# EasyEDA schematic EasyEDA_Source.json
TITLE: Meadow CCM Add-on Module - Dual Ethernet; REV: v1.b; Date: 2022.03; Sheet: 1/1; Drawn By: bryan costanich; Company: Wilderness Labs
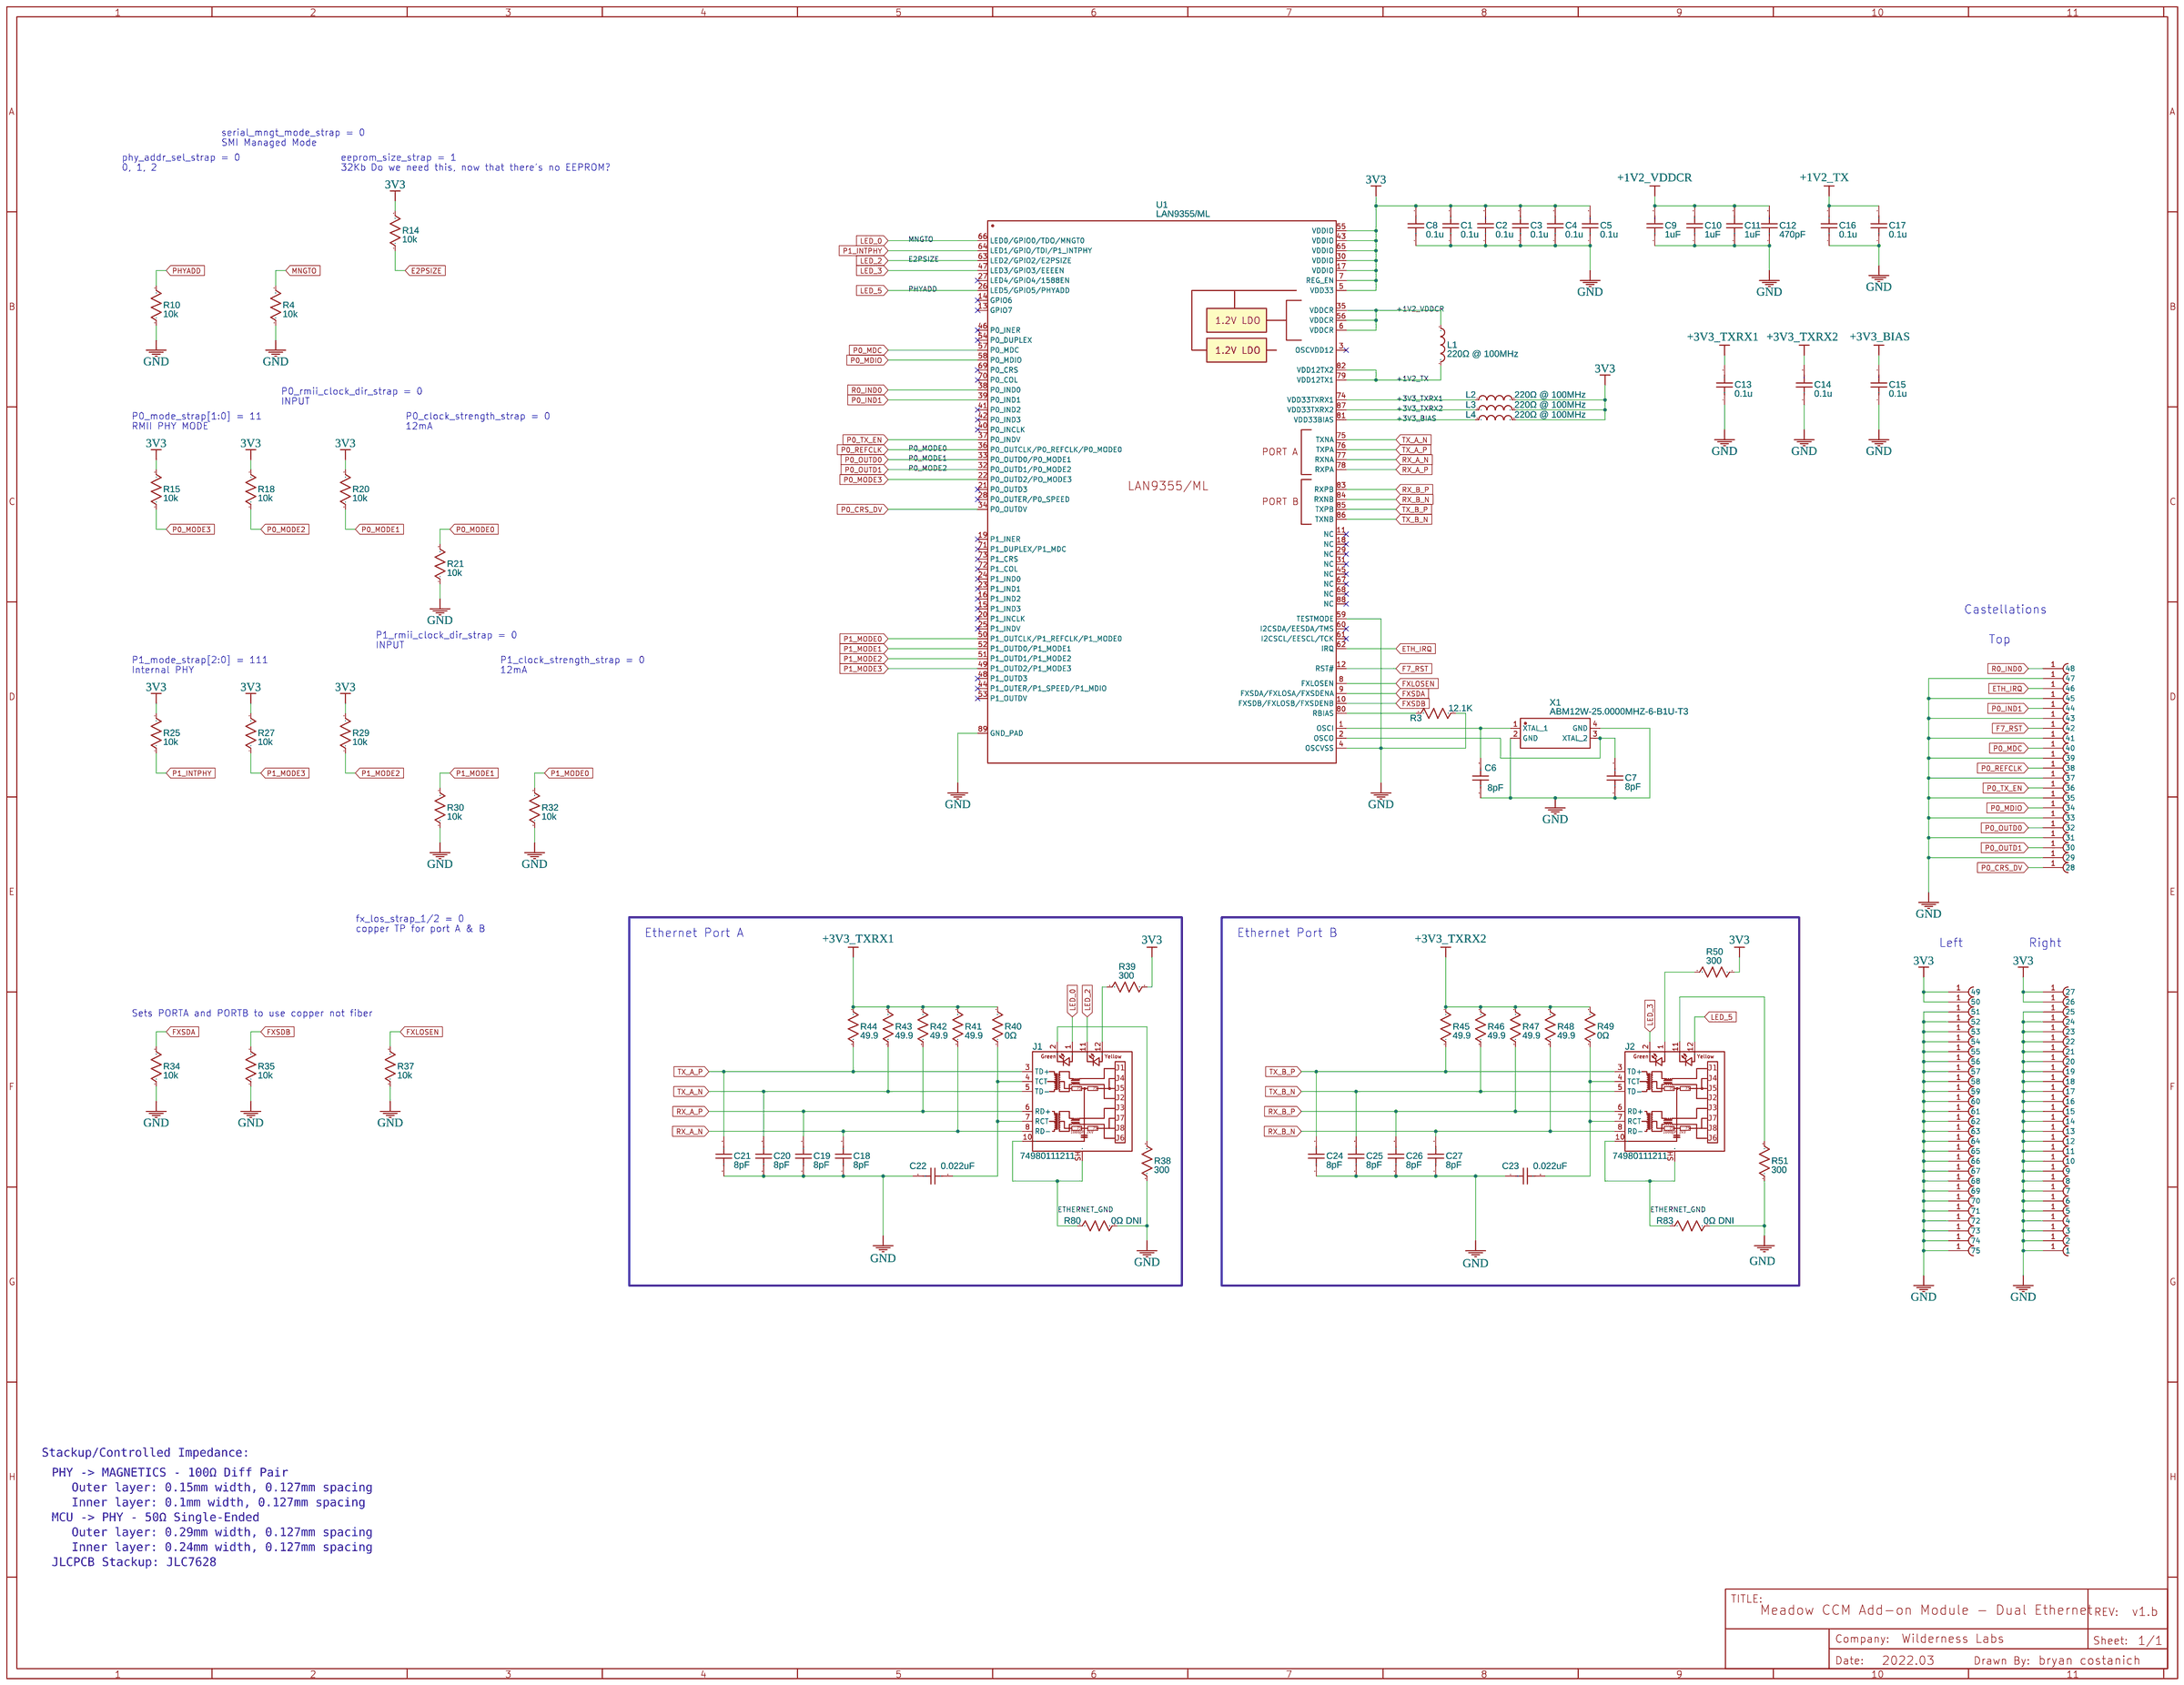
[diagram p0: schematic sheet]

## Parts
C1  0.1u  [C0603]
C2  0.1u  [C0603]
C3  0.1u  [C0603]
C4  0.1u  [C0603]
C5  0.1u  [C0603]
C6  8pF  [C0603]
C7  8pF  [C0603]
C8  0.1u  [C0603]
C9  1uF  [C0603]
C10  1uF  [C0603]
C11  1uF  [C0603]
C12  470pF  [C0603]
C13  0.1u  [C0603]
C14  0.1u  [C0603]
C15  0.1u  [C0603]
C16  0.1u  [C0603]
C17  0.1u  [C0603]
C18  8pF  [C0603]
C19  8pF  [C0603]
C20  8pF  [C0603]
C21  8pF  [C0603]
C22  0.022uF  [C0603]
C23  0.022uF  [C0603]
C24  8pF  [C0603]
C25  8pF  [C0603]
C26  8pF  [C0603]
C27  8pF  [C0603]
J1  74980111211  [74980111211]
J2  74980111211  [74980111211]
L1  220Ω @ 100MHz  [L0603]
L2  220Ω @ 100MHz  [L0603]
L3  220Ω @ 100MHz  [L0603]
L4  220Ω @ 100MHz  [L0603]
R3  12.1K  [R0603]
R4  10k  [R0603]
R10  10k  [R0603]
R14  10k  [R0603]
R15  10k  [R0603]
R18  10k  [R0603]
R20  10k  [R0603]
R21  10k  [R0603]
R25  10k  [R0603]
R27  10k  [R0603]
R29  10k  [R0603]
R30  10k  [R0603]
R32  10k  [R0603]
R34  10k  [R0603]
R35  10k  [R0603]
R37  10k  [R0603]
R38  300  [R0603]
R39  300  [R0603]
R40  0Ω  [R0603]
R41  49.9  [R0603]
R42  49.9  [R0603]
R43  49.9  [R0603]
R44  49.9  [R0603]
R45  49.9  [R0603]
R46  49.9  [R0603]
R47  49.9  [R0603]
R48  49.9  [R0603]
R49  0Ω  [R0603]
R50  300  [R0603]
R51  300  [R0603]
R80  0Ω DNI  [R0603]
R83  0Ω DNI  [R0603]
U1  LAN9355/ML  [QFN-88_L12.0-W12.0-P0.5]
U2  1.2MM SMT Castellation  [1.2MM SMT CASTELLATION]
U3  1.2MM SMT Castellation  [1.2MM SMT CASTELLATION]
U4  1.2MM SMT Castellation  [1.2MM SMT CASTELLATION]
U5  1.2MM SMT Castellation  [1.2MM SMT CASTELLATION]
U6  1.2MM SMT Castellation  [1.2MM SMT CASTELLATION]
U7  1.2MM SMT Castellation  [1.2MM SMT CASTELLATION]
U8  1.2MM SMT Castellation  [1.2MM SMT CASTELLATION]
U9  1.2MM SMT Castellation  [1.2MM SMT CASTELLATION]
U10  1.2MM SMT Castellation  [1.2MM SMT CASTELLATION]
U11  1.2MM SMT Castellation  [1.2MM SMT CASTELLATION]
U12  WILDERNESS_LABS_LOGO_HORIZONTAL_MEDIUM  [WILDERNESS_LABS_LOGO_HORIZONTAL_MEDIUM]
U13  1.2MM SMT Castellation  [1.2MM SMT CASTELLATION]
U14  1.2MM SMT Castellation  [1.2MM SMT CASTELLATION]
U15  1.2MM SMT Castellation  [1.2MM SMT CASTELLATION]
U16  1.2MM SMT Castellation  [1.2MM SMT CASTELLATION]
U17  1.2MM SMT Castellation  [1.2MM SMT CASTELLATION]
U18  1.2MM SMT Castellation  [1.2MM SMT CASTELLATION]
U19  1.2MM SMT Castellation  [1.2MM SMT CASTELLATION]
U20  1.2MM SMT Castellation  [1.2MM SMT CASTELLATION]
U21  1.2MM SMT Castellation  [1.2MM SMT CASTELLATION]
U22  1.2MM SMT Castellation  [1.2MM SMT CASTELLATION]
U23  1.2MM SMT Castellation  [1.2MM SMT CASTELLATION]
U24  1.2MM SMT Castellation  [1.2MM SMT CASTELLATION]
U25  1.2MM SMT Castellation  [1.2MM SMT CASTELLATION]
U26  1.2MM SMT Castellation  [1.2MM SMT CASTELLATION]
U27  1.2MM SMT Castellation  [1.2MM SMT CASTELLATION]
U28  1.2MM SMT Castellation  [1.2MM SMT CASTELLATION]
U29  1.2MM SMT Castellation  [1.2MM SMT CASTELLATION]
U30  1.2MM SMT Castellation  [1.2MM SMT CASTELLATION]
U31  1.2MM SMT Castellation  [1.2MM SMT CASTELLATION]
U32  1.2MM SMT Castellation  [1.2MM SMT CASTELLATION]
U33  1.2MM SMT Castellation  [1.2MM SMT CASTELLATION]
U34  1.2MM SMT Castellation  [1.2MM SMT CASTELLATION]
U35  1.2MM SMT Castellation  [1.2MM SMT CASTELLATION]
U36  1.2MM SMT Castellation  [1.2MM SMT CASTELLATION]
U37  1.2MM SMT Castellation  [1.2MM SMT CASTELLATION]
U38  1.2MM SMT Castellation  [1.2MM SMT CASTELLATION]
U39  1.2MM SMT Castellation  [1.2MM SMT CASTELLATION]
U40  1.2MM SMT Castellation  [1.2MM SMT CASTELLATION]
U41  1.2MM SMT Castellation  [1.2MM SMT CASTELLATION]
U42  1.2MM SMT Castellation  [1.2MM SMT CASTELLATION]
U43  1.2MM SMT Castellation  [1.2MM SMT CASTELLATION]
U44  1.2MM SMT Castellation  [1.2MM SMT CASTELLATION]
U45  1.2MM SMT Castellation  [1.2MM SMT CASTELLATION]
U46  1.2MM SMT Castellation  [1.2MM SMT CASTELLATION]
U47  1.2MM SMT Castellation  [1.2MM SMT CASTELLATION]
U48  1.2MM SMT Castellation  [1.2MM SMT CASTELLATION]
U49  1.2MM SMT Castellation  [1.2MM SMT CASTELLATION]
U50  1.2MM SMT Castellation  [1.2MM SMT CASTELLATION]
U51  1.2MM SMT Castellation  [1.2MM SMT CASTELLATION]
U52  1.2MM SMT Castellation  [1.2MM SMT CASTELLATION]
U53  1.2MM SMT Castellation  [1.2MM SMT CASTELLATION]
U54  1.2MM SMT Castellation  [1.2MM SMT CASTELLATION]
U55  1.2MM SMT Castellation  [1.2MM SMT CASTELLATION]
U56  1.2MM SMT Castellation  [1.2MM SMT CASTELLATION]
U57  1.2MM SMT Castellation  [1.2MM SMT CASTELLATION]
U58  1.2MM SMT Castellation  [1.2MM SMT CASTELLATION]
U59  1.2MM SMT Castellation  [1.2MM SMT CASTELLATION]
U60  1.2MM SMT Castellation  [1.2MM SMT CASTELLATION]
U61  1.2MM SMT Castellation  [1.2MM SMT CASTELLATION]
U62  1.2MM SMT Castellation  [1.2MM SMT CASTELLATION]
U63  1.2MM SMT Castellation  [1.2MM SMT CASTELLATION]
U64  1.2MM SMT Castellation  [1.2MM SMT CASTELLATION]
U65  1.2MM SMT Castellation  [1.2MM SMT CASTELLATION]
U66  1.2MM SMT Castellation  [1.2MM SMT CASTELLATION]
U67  1.2MM SMT Castellation  [1.2MM SMT CASTELLATION]
U68  1.2MM SMT Castellation  [1.2MM SMT CASTELLATION]
U69  1.2MM SMT Castellation  [1.2MM SMT CASTELLATION]
U70  1.2MM SMT Castellation  [1.2MM SMT CASTELLATION]
U71  1.2MM SMT Castellation  [1.2MM SMT CASTELLATION]
U72  1.2MM SMT Castellation  [1.2MM SMT CASTELLATION]
U73  1.2MM SMT Castellation  [1.2MM SMT CASTELLATION]
U74  1.2MM SMT Castellation  [1.2MM SMT CASTELLATION]
U75  1.2MM SMT Castellation  [1.2MM SMT CASTELLATION]
U76  1.2MM SMT Castellation  [1.2MM SMT CASTELLATION]
U78  1.2MM SMT Castellation  [1.2MM SMT CASTELLATION]
X1  ABM12W-25.0000MHZ-6-B1U-T3  [OSC-SMD_4P-L1.6-W1.2-BL]

## Library data of the parts
C1-C5 C8 C13-C17 = C_0603_US: Contributor: LCEDA_Lib; Manufacturer Part: CC0603KRX7R7BB104; Manufacturer: Yageo
C6 C7 C18-C21 C24-C27 = C_0603_US: Contributor: LCEDA_Lib; Manufacturer Part: CC0603DRNPO9BN8R0; Manufacturer: Yageo
C9-C11 = C_0603_US: Contributor: LCEDA_Lib; Manufacturer Part: CC0603ZRY5V6BB105; Manufacturer: Yageo
C12 = C_0603_US: Contributor: LCEDA_Lib; Manufacturer Part: CC0603KRX7R9BB471; Manufacturer: Yageo
C22 C23 = C_0603_US: Contributor: LCEDA_Lib; Manufacturer Part: CC0603KRX7R8BB223; Manufacturer: Yageo
J1 J2 = 74980111211: Contributor: Fly_0ut; Manufacturer: Wurth Elektronik
L1-L4 = L0603_US: Contributor: LCEDA_Lib; Manufacturer Part: BLM18KG221SN1D; Manufacturer: Murata
R3 = R_0603_US: Contributor: LCEDA_Lib; Manufacturer Part: RC0603FR-0712K1L; Manufacturer: Yageo
R4 R10 R14 R15 R18 R20 R21 R25 R27 R29 R30 R32 R34 R35 R37 = R_0603_US: Contributor: LCEDA_Lib; Manufacturer Part: RC0603FR-0710KL; Manufacturer: Yageo
R38 R39 R50 R51 = R_0603_US: Contributor: LCEDA_Lib; Manufacturer Part: RC0603FR-07300RL; Manufacturer: Yageo
R40 R49 R80 R83 = R_0603_US: Contributor: LCEDA_Lib; Manufacturer Part: RC0603JR-070RL; Manufacturer: Yageo
R41-R48 = R_0603_US: Contributor: LCEDA_Lib; Manufacturer Part: RC0603FR-0749R9L; Manufacturer: Yageo
U1 = LAN9355/ML: Manufacturer: Microchip; Manufacturer Part: LAN9355I/ML; link: https://www.microchip.com/wwwproducts/en/LAN9355; Contributor: bryan_6020
U2-U11 U13-U76 U78 = 1.2MM SMT Castellation: Contributor: bryan_6020
U12 = WILDERNESS_LABS_LOGO_HORIZONTAL_MEDIUM: Contributor: bryan costanich
X1 = ABM12W-25.0000MHZ-6-B1U-T3: Manufacturer: Abracon; link: https://abracon.com/parametric/oscillators/ASFL1-12.000MHZ-EK-T; Contributor: bryan costanich

## Nets
3V3: C1.2 C2.2 C3.2 C4.2 C5.2 C8.2 L2.2 L3.2 L4.2 R14.2 R15.2 R18.2 R20.2 R25.2 R27.2 R29.2 R39.1 R50.1 U1.5(VDD33) U1.7(REG_EN) U1.17(VDDIO) U1.30(VDDIO) U1.43(VDDIO) U1.55(VDDIO) U1.65(VDDIO) U13.1(50) U50.1(26) U53.1(49) U71.1(27)
+1V2_TX: C16.2 C17.2 L1.2 U1.79(VDD12TX1) U1.82(VDD12TX2)
+1V2_VDDCR: C9.2 C10.2 C11.2 C12.2 L1.1 U1.6(VDDCR) U1.35(VDDCR) U1.56(VDDCR)
+3V3_BIAS: C15.2 L4.1 U1.81(VDD33BIAS)
+3V3_TXRX1: C13.2 L2.1 R40.2 R41.2 R42.2 R43.2 R44.2 U1.74(VDD33TXRX1)
+3V3_TXRX2: C14.2 L3.1 R45.2 R46.2 R47.2 R48.2 R49.2 U1.87(VDD33TXRX2)
GND: C1.1 C2.1 C3.1 C4.1 C5.1 C6.1 C7.1 C8.1 C9.1 C10.1 C11.1 C12.1 C13.1 C14.1 C15.1 C16.1 C17.1 C18.1 C19.1 C20.1 C21.1 C22.1 C23.1 C24.1 C25.1 C26.1 C27.1 R3.1 R4.1 R10.1 R21.1 R30.1 R32.1 R34.1 R35.1 R37.1 R38.1 R51.1 R80.2 R83.2 U1.4(OSCVSS) U1.59(TESTMODE) U1.89(GND_PAD) U3.1(29) U5.1(31) U7.1(33) U9.1(35) U11.1(37) U14.1(51) U15.1(2) U16.1(52) U17.1(3) U18.1(4) U19.1(53) U21.1(5) U22.1(6) U23.1(54) U24.1(39) U25.1(7) U27.1(8) U28.1(9) U29.1(10) U30.1(41) U31.1(11) U32.1(12) U33.1(13) U34.1(14) U35.1(15) U36.1(16) U37.1(17) U38.1(18) U39.1(19) U40.1(20) U41.1(55) U42.1(21) U43.1(22) U44.1(23) U46.1(43) U48.1(24) U49.1(25) U51.1(56) U52.1(57) U54.1(58) U55.1(59) U56.1(60) U57.1(45) U58.1(61) U59.1(62) U60.1(63) U61.1(64) U62.1(65) U63.1(66) U64.1(67) U65.1(68) U66.1(69) U68.1(70) U69.1(71) U70.1(72) U72.1(73) U73.1(74) U74.1(47) U75.1(75) U78.1 X1.2(GND) X1.4(GND)
E2PSIZE: J1.11 R14.1 U1.63(LED2/GPIO2/E2PSIZE)
ETH_IRQ: U1.62(IRQ) U67.1(46)
ETHERNET_GND: J1.10(CHS) J1.SH J2.10(CHS) J2.SH R80.1 R83.1
F7_RST: U1.12(RST#) U45.1(42)
FXLOSEN: R37.2 U1.8(FXLOSEN)
FXSDA: R34.2 U1.9(FXSDA/FXLOSA/FXSDENA)
FXSDB: R35.2 U1.10(FXSDB/FXLOSB/FXSDENB)
LED_0: J1.1 R4.2 U1.66(LED0/GPIO0/TDO/MNGT0)
LED_3: J2.2 U1.47(LED3/GPIO3/EEEEN)
LED_5: J2.12 R10.2 U1.26(LED5/GPIO5/PHYADD)
P0_CRS_DV: U1.34(P0_OUTDV) U2.1(28)
P0_IND1: U1.39(P0_IND1) U47.1(44)
P0_MDC: U1.57(P0_MDC) U26.1(40)
P0_MDIO: U1.58(P0_MDIO) U8.1(34)
P0_MODE0: R21.2 U1.36(P0_OUTCLK/P0_REFCLK/P0_MODE0) U20.1(38)
P0_MODE1: R20.1 U1.33(P0_OUTD0/P0_MODE1) U6.1(32)
P0_MODE2: R18.1 U1.32(P0_OUTD1/P0_MODE2) U4.1(30)
P0_MODE3: R15.1 U1.22(P0_OUTD2/PO_MODE3)
P0_TX_EN: U1.37(P0_INDV) U10.1(36)
P1_INTPHY: R25.1 U1.64(LED1/GPIO/TDI/P1_INTPHY)
P1_MODE0: R32.2 U1.50(P1_OUTCLK/P1_REFCLK/P1_MODE0)
P1_MODE1: R30.2 U1.52(P1_OUTD0/P1_MODE1)
P1_MODE2: R29.1 U1.51(P1_OUTD1/P1_MODE2)
P1_MODE3: R27.1 U1.49(P1_OUTD2/P1_MODE3)
R0_IND0: U1.38(P0_IND0) U76.1(48)
RX_A_N: C18.2 J1.8(RD-) R41.1 U1.77(RXNA)
RX_A_P: C19.2 J1.6(RD+) R42.1 U1.78(RXPA)
RX_B_N: C27.2 J2.8(RD-) R48.1 U1.84(RXNB)
RX_B_P: C26.2 J2.6(RD+) R47.1 U1.83(RXPB)
TX_A_N: C20.2 J1.5(TD-) R43.1 U1.75(TXNA)
TX_A_P: C21.2 J1.3(TD+) R44.1 U1.76(TXPA)
TX_B_N: C25.2 J2.5(TD-) R46.1 U1.86(TXNB)
TX_B_P: C24.2 J2.3(TD+) R45.1 U1.85(TXPB)
Net-(C6-2): C6.2 U1.1(OSCI) X1.1(XTAL)
Net-(C7-2): C7.2 U1.2(OSCO) X1.3(XTAL_2)
Net-(C22-2): C22.2 J1.4(TCT) J1.7(RCT) R40.1
Net-(C23-2): C23.2 J2.4(TCT) J2.7(RCT) R49.1
Net-(J1-2): J1.2 R38.2
Net-(J1-12): J1.12 R39.2
Net-(J2-1): J2.1 R50.2
Net-(J2-11): J2.11 R51.2
Net-(R3-2): R3.2 U1.80(RBIAS)

Not connected (* = marked no-connect by the designer): U1 3(OSCVDD12)* 11(NC)* 13(GPIO7)* 14(GPIO6)* 15(P1_IND3)* 16(P1_IND2)* 18(NC)* 19(P1_INER)* 20(P1_INCLK)* 21(P0_OUTD3)* 23(P1_IND1)* 24(P1_IND0)* 25(P1_INDV)* 27(LED4/GPIO4/1588EN)* 28(P0_OUTER/P0_SPEED)* 29(NC)* 31(NC)* 40(P0_INCLK)* 41(P0_IND2)* 42(P0_IND3)* 44(P1_OUTER/P1_SPEED/P1_MDIO)* 45(NC)* 46(P0_INER)* 48(P1_OUTD3)* 53(P1_OUTDV)* 54(P0_DUPLEX)* 60(I2CSDA/EESDA/TMS)* 61(I2CSCL/EESCL/TCK)* 67(NC)* 68(NC)* 69(P0_CRS)* 70(P0_COL)* 71(P1_DUPLEX/P1_MDC)* 72(P1_COL)* 73(P1_CRS)* 88(NC)*

## Notes on the sheet
- serial_mngt_mode_strap = 0
- SMI Managed Mode
- 0, 1, 2
- phy_addr_sel_strap = 0
- 32Kb
- eeprom_size_strap = 1
- Do we need this, now that there's no EEPROM?
- P0_rmii_clock_dir_strap = 0
- INPUT
- P0_mode_strap[1:0] = 11
- RMII PHY MODE
- 12mA
- P0_clock_strength_strap = 0
- Castellations
- P1_rmii_clock_dir_strap = 0
- Top
- INPUT
- P1_mode_strap[2:0] = 111
- P1_clock_strength_strap = 0
- Internal PHY
- 12mA
- fx_los_strap_1/2 = 0
- copper TP for port A & B
- Ethernet Port A
- Ethernet Port B
- Left
- Right
- Sets PORTA and PORTB to use copper not fiber
- Stackup/Controlled Impedance:
- PHY -> MAGNETICS - 100Ω Diff Pair
- Outer layer: 0.15mm width, 0.127mm spacing
- Inner layer: 0.1mm width, 0.127mm spacing
- MCU -> PHY - 50Ω Single-Ended
- Outer layer: 0.29mm width, 0.127mm spacing
- Inner layer: 0.24mm width, 0.127mm spacing
- JLCPCB Stackup: JLC7628
